# EAGLE design avraic (EAGLE 7.4.0)
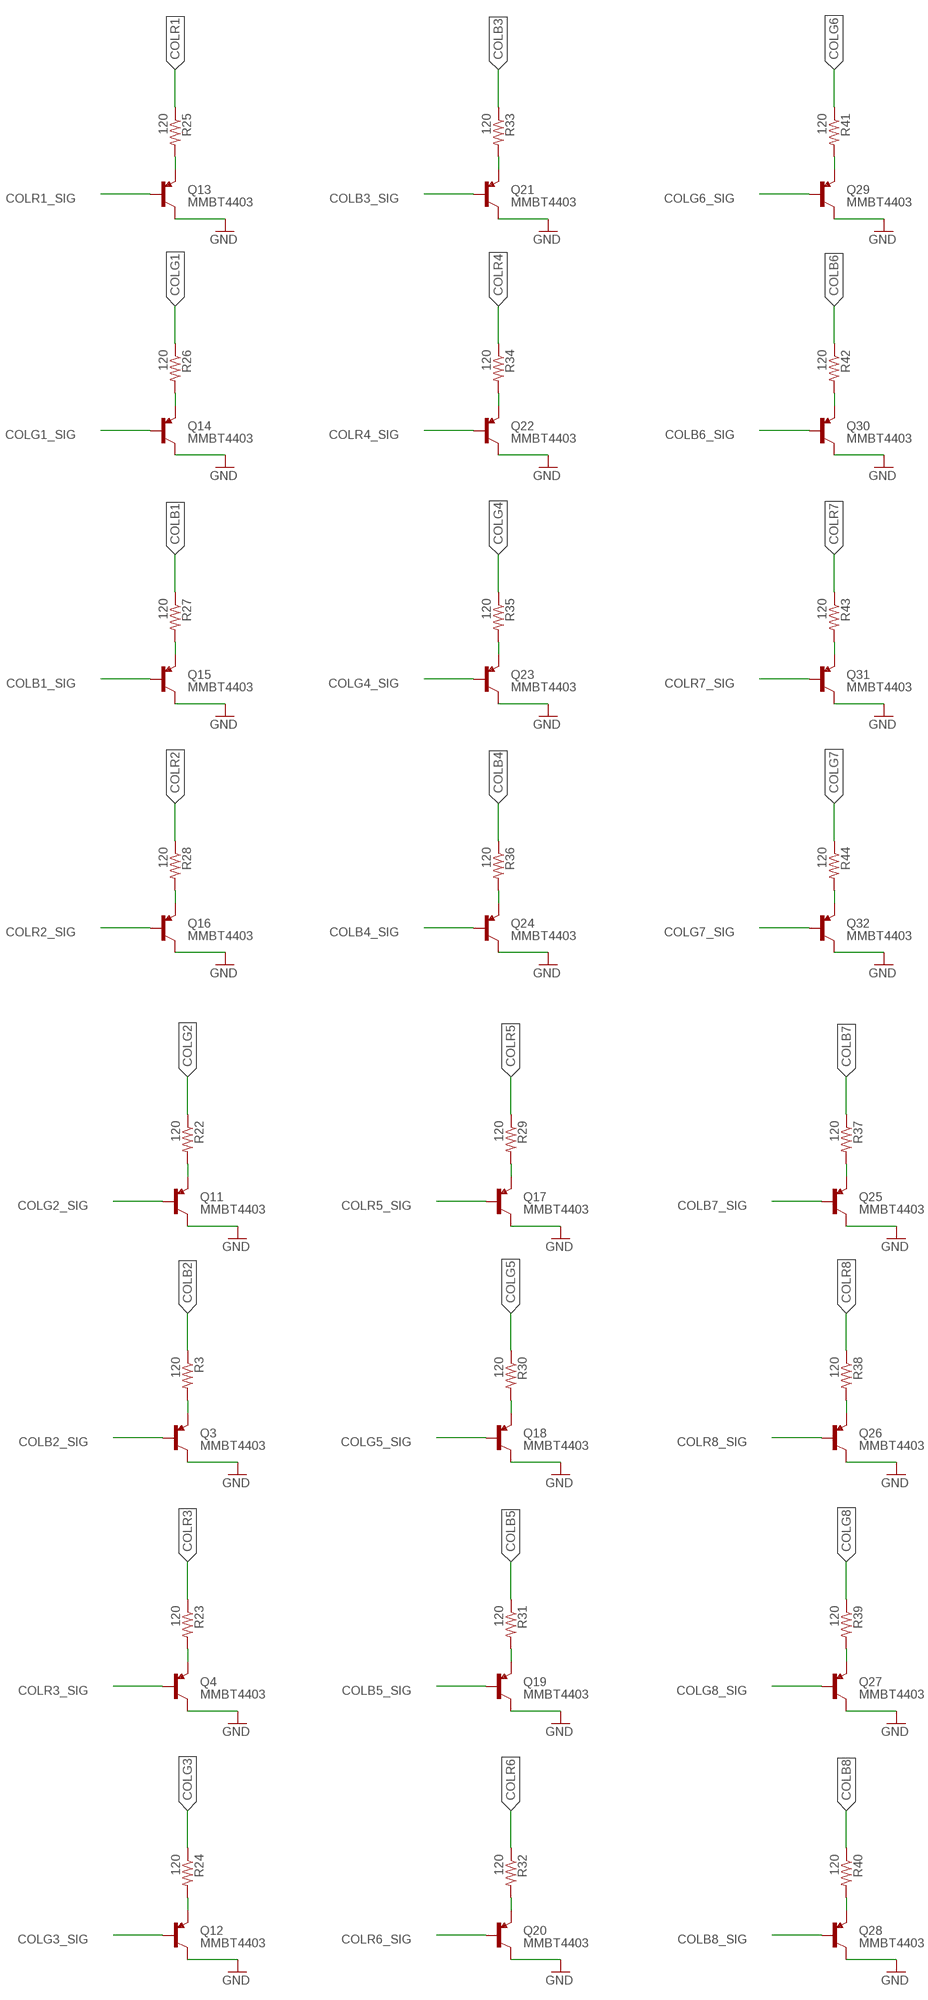
[diagram p0: schematic, sheet 1, part 1 of 3]
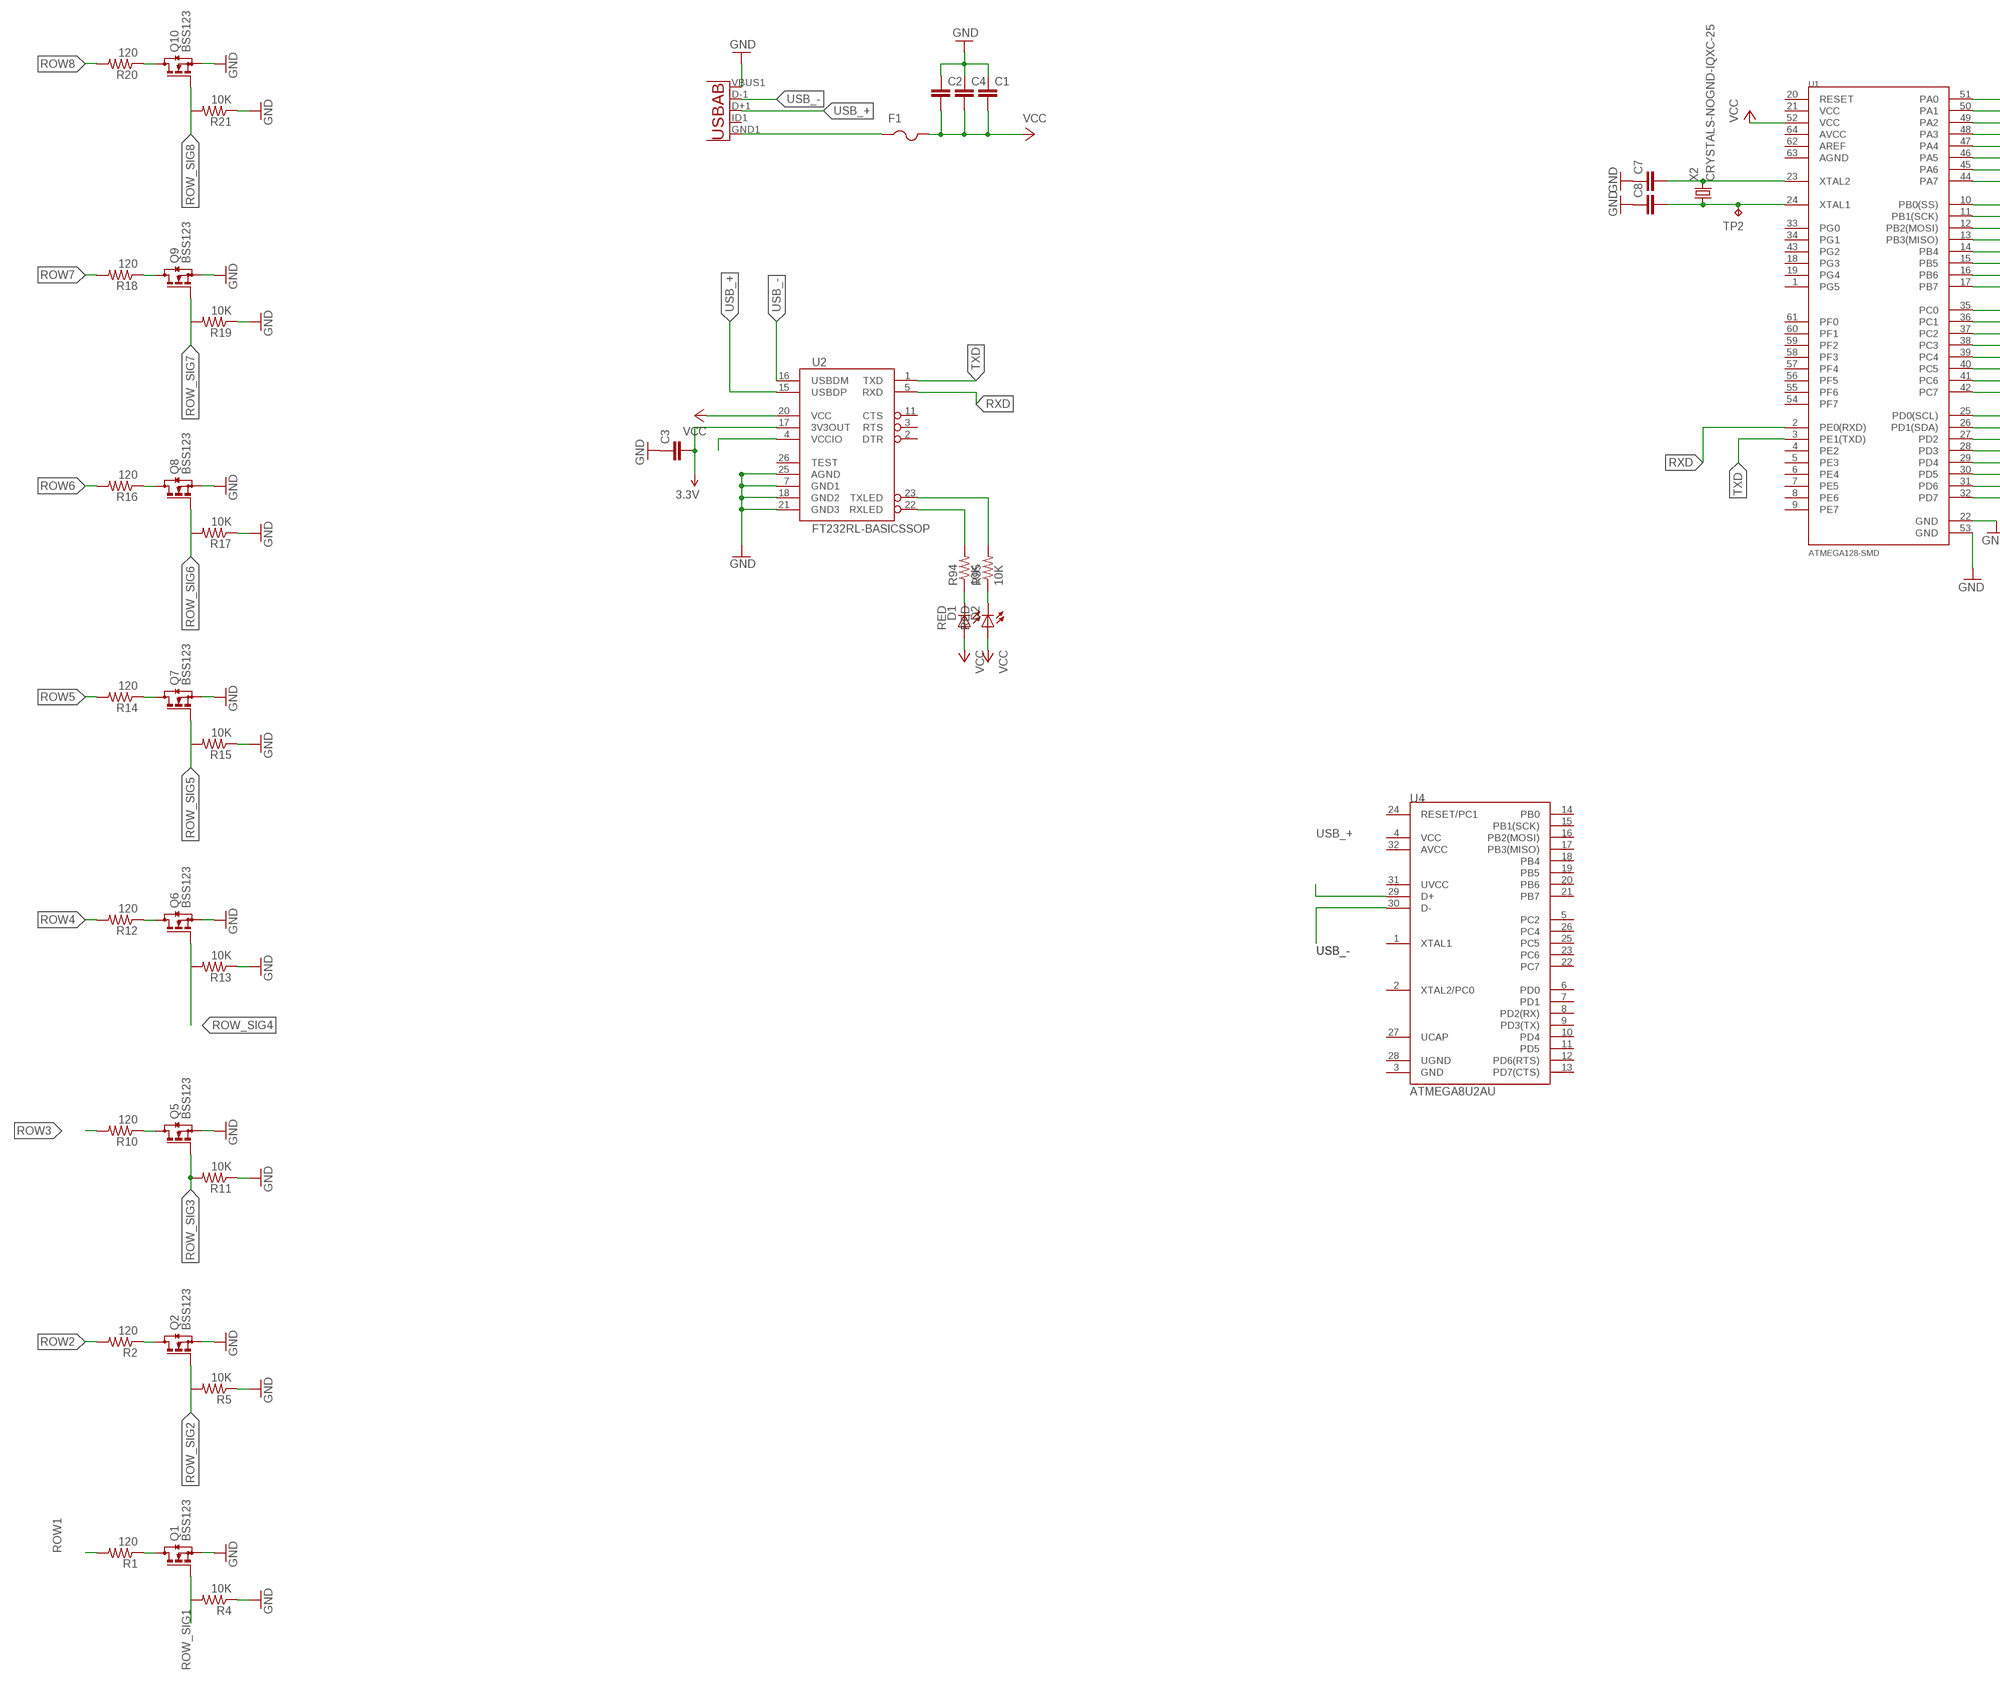
[diagram p1: schematic, sheet 1, part 2 of 3]
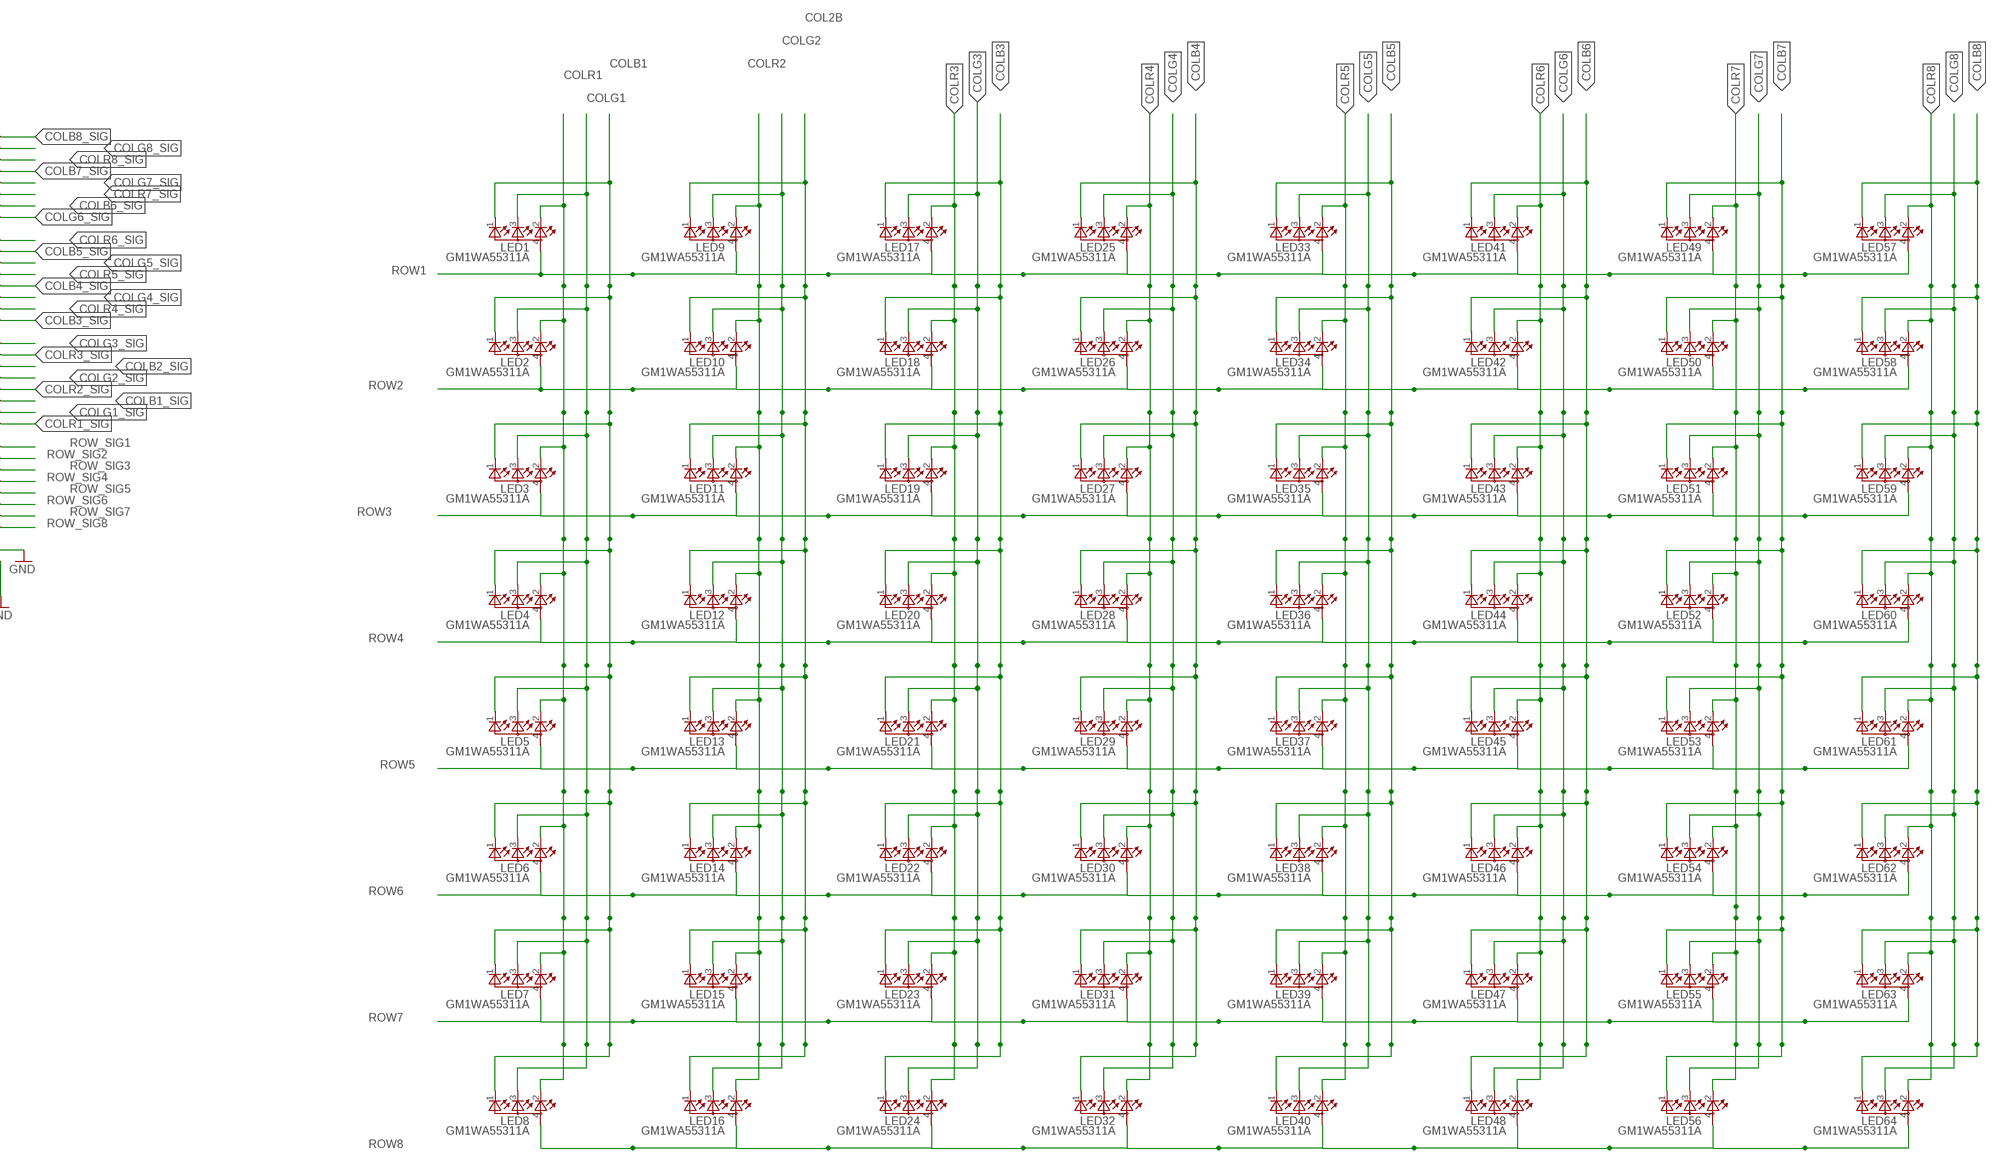
[diagram p2: schematic, sheet 1, part 3 of 3]

## Parts
C1  C-EUC0201  [C0201]
C2  C-EUC0201  [C0201]
C3  C-EUC0402K  [C0402K]
C4  C-EUC0201  [C0201]
C7  C-EUC0402K  [C0402K]
C8  C-EUC0402K  [C0402K]
D1  RED  LEDCHIP-LED0603  [CHIP-LED0603]
D2  RED  LEDCHIP-LED0603  [CHIP-LED0603]
F1  PTCFUSE-1206  [R1206]
LED1  GM1WA55311A  [GM1WA55311A]
LED2  GM1WA55311A  [GM1WA55311A]
LED3  GM1WA55311A  [GM1WA55311A]
LED4  GM1WA55311A  [GM1WA55311A]
LED5  GM1WA55311A  [GM1WA55311A]
LED6  GM1WA55311A  [GM1WA55311A]
LED7  GM1WA55311A  [GM1WA55311A]
LED8  GM1WA55311A  [GM1WA55311A]
LED9  GM1WA55311A  [GM1WA55311A]
LED10  GM1WA55311A  [GM1WA55311A]
LED11  GM1WA55311A  [GM1WA55311A]
LED12  GM1WA55311A  [GM1WA55311A]
LED13  GM1WA55311A  [GM1WA55311A]
LED14  GM1WA55311A  [GM1WA55311A]
LED15  GM1WA55311A  [GM1WA55311A]
LED16  GM1WA55311A  [GM1WA55311A]
LED17  GM1WA55311A  [GM1WA55311A]
LED18  GM1WA55311A  [GM1WA55311A]
LED19  GM1WA55311A  [GM1WA55311A]
LED20  GM1WA55311A  [GM1WA55311A]
LED21  GM1WA55311A  [GM1WA55311A]
LED22  GM1WA55311A  [GM1WA55311A]
LED23  GM1WA55311A  [GM1WA55311A]
LED24  GM1WA55311A  [GM1WA55311A]
LED25  GM1WA55311A  [GM1WA55311A]
LED26  GM1WA55311A  [GM1WA55311A]
LED27  GM1WA55311A  [GM1WA55311A]
LED28  GM1WA55311A  [GM1WA55311A]
LED29  GM1WA55311A  [GM1WA55311A]
LED30  GM1WA55311A  [GM1WA55311A]
LED31  GM1WA55311A  [GM1WA55311A]
LED32  GM1WA55311A  [GM1WA55311A]
LED33  GM1WA55311A  [GM1WA55311A]
LED34  GM1WA55311A  [GM1WA55311A]
LED35  GM1WA55311A  [GM1WA55311A]
LED36  GM1WA55311A  [GM1WA55311A]
LED37  GM1WA55311A  [GM1WA55311A]
LED38  GM1WA55311A  [GM1WA55311A]
LED39  GM1WA55311A  [GM1WA55311A]
LED40  GM1WA55311A  [GM1WA55311A]
LED41  GM1WA55311A  [GM1WA55311A]
LED42  GM1WA55311A  [GM1WA55311A]
LED43  GM1WA55311A  [GM1WA55311A]
LED44  GM1WA55311A  [GM1WA55311A]
LED45  GM1WA55311A  [GM1WA55311A]
LED46  GM1WA55311A  [GM1WA55311A]
LED47  GM1WA55311A  [GM1WA55311A]
LED48  GM1WA55311A  [GM1WA55311A]
LED49  GM1WA55311A  [GM1WA55311A]
LED50  GM1WA55311A  [GM1WA55311A]
LED51  GM1WA55311A  [GM1WA55311A]
LED52  GM1WA55311A  [GM1WA55311A]
LED53  GM1WA55311A  [GM1WA55311A]
LED54  GM1WA55311A  [GM1WA55311A]
LED55  GM1WA55311A  [GM1WA55311A]
LED56  GM1WA55311A  [GM1WA55311A]
LED57  GM1WA55311A  [GM1WA55311A]
LED58  GM1WA55311A  [GM1WA55311A]
LED59  GM1WA55311A  [GM1WA55311A]
LED60  GM1WA55311A  [GM1WA55311A]
LED61  GM1WA55311A  [GM1WA55311A]
LED62  GM1WA55311A  [GM1WA55311A]
LED63  GM1WA55311A  [GM1WA55311A]
LED64  GM1WA55311A  [GM1WA55311A]
Q1  BSS123  [SOT23]
Q2  BSS123  [SOT23]
Q3  MMBT4403  TRANSISTOR_PNPMMBT4403  [SOT23-3]
Q4  MMBT4403  TRANSISTOR_PNPMMBT4403  [SOT23-3]
Q5  BSS123  [SOT23]
Q6  BSS123  [SOT23]
Q7  BSS123  [SOT23]
Q8  BSS123  [SOT23]
Q9  BSS123  [SOT23]
Q10  BSS123  [SOT23]
Q11  MMBT4403  TRANSISTOR_PNPMMBT4403  [SOT23-3]
Q12  MMBT4403  TRANSISTOR_PNPMMBT4403  [SOT23-3]
Q13  MMBT4403  TRANSISTOR_PNPMMBT4403  [SOT23-3]
Q14  MMBT4403  TRANSISTOR_PNPMMBT4403  [SOT23-3]
Q15  MMBT4403  TRANSISTOR_PNPMMBT4403  [SOT23-3]
Q16  MMBT4403  TRANSISTOR_PNPMMBT4403  [SOT23-3]
Q17  MMBT4403  TRANSISTOR_PNPMMBT4403  [SOT23-3]
Q18  MMBT4403  TRANSISTOR_PNPMMBT4403  [SOT23-3]
Q19  MMBT4403  TRANSISTOR_PNPMMBT4403  [SOT23-3]
Q20  MMBT4403  TRANSISTOR_PNPMMBT4403  [SOT23-3]
Q21  MMBT4403  TRANSISTOR_PNPMMBT4403  [SOT23-3]
Q22  MMBT4403  TRANSISTOR_PNPMMBT4403  [SOT23-3]
Q23  MMBT4403  TRANSISTOR_PNPMMBT4403  [SOT23-3]
Q24  MMBT4403  TRANSISTOR_PNPMMBT4403  [SOT23-3]
Q25  MMBT4403  TRANSISTOR_PNPMMBT4403  [SOT23-3]
Q26  MMBT4403  TRANSISTOR_PNPMMBT4403  [SOT23-3]
Q27  MMBT4403  TRANSISTOR_PNPMMBT4403  [SOT23-3]
Q28  MMBT4403  TRANSISTOR_PNPMMBT4403  [SOT23-3]
Q29  MMBT4403  TRANSISTOR_PNPMMBT4403  [SOT23-3]
Q30  MMBT4403  TRANSISTOR_PNPMMBT4403  [SOT23-3]
Q31  MMBT4403  TRANSISTOR_PNPMMBT4403  [SOT23-3]
Q32  MMBT4403  TRANSISTOR_PNPMMBT4403  [SOT23-3]
R1  120  RESISTOR0603-RES  [0603-RES]
R2  120  RESISTOR0603-RES  [0603-RES]
R3  120  R-US_MELF0102R  [MINI_MELF-0102R]
R4  10K  RESISTOR0603-RES  [0603-RES]
R5  10K  RESISTOR0603-RES  [0603-RES]
R10  120  RESISTOR0603-RES  [0603-RES]
R11  10K  RESISTOR0603-RES  [0603-RES]
R12  120  RESISTOR0603-RES  [0603-RES]
R13  10K  RESISTOR0603-RES  [0603-RES]
R14  120  RESISTOR0603-RES  [0603-RES]
R15  10K  RESISTOR0603-RES  [0603-RES]
R16  120  RESISTOR0603-RES  [0603-RES]
R17  10K  RESISTOR0603-RES  [0603-RES]
R18  120  RESISTOR0603-RES  [0603-RES]
R19  10K  RESISTOR0603-RES  [0603-RES]
R20  120  RESISTOR0603-RES  [0603-RES]
R21  10K  RESISTOR0603-RES  [0603-RES]
R22  120  R-US_MELF0102R  [MINI_MELF-0102R]
R23  120  R-US_MELF0102R  [MINI_MELF-0102R]
R24  120  RESISTOR0603-RES  [0603-RES]
R25  120  RESISTOR0603-RES  [0603-RES]
R26  120  R-US_MELF0102R  [MINI_MELF-0102R]
R27  120  R-US_MELF0102R  [MINI_MELF-0102R]
R28  120  R-US_MELF0102R  [MINI_MELF-0102R]
R29  120  R-US_MELF0102R  [MINI_MELF-0102R]
R30  120  RESISTOR0603-RES  [0603-RES]
R31  120  RESISTOR0603-RES  [0603-RES]
R32  120  RESISTOR0603-RES  [0603-RES]
R33  120  R-US_MELF0102R  [MINI_MELF-0102R]
R34  120  R-US_MELF0102R  [MINI_MELF-0102R]
R35  120  R-US_MELF0102R  [MINI_MELF-0102R]
R36  120  R-US_MELF0102R  [MINI_MELF-0102R]
R37  120  R-US_MELF0102R  [MINI_MELF-0102R]
R38  120  R-US_MELF0102R  [MINI_MELF-0102R]
R39  120  R-US_MELF0102R  [MINI_MELF-0102R]
R40  120  R-US_MELF0102R  [MINI_MELF-0102R]
R41  120  R-US_MELF0102R  [MINI_MELF-0102R]
R42  120  R-US_MELF0102R  [MINI_MELF-0102R]
R43  120  R-US_MELF0102R  [MINI_MELF-0102R]
R44  120  R-US_MELF0102R  [MINI_MELF-0102R]
R94  10K  RESISTOR0603-RES  [0603-RES]
R95  10K  RESISTOR0603-RES  [0603-RES]
TP2  TPB1,27  [B1,27]
U1  ATMEGA128-SMD  [TQFP64_14X14MM]
U2  FT232RL-BASICSSOP  [SSOP28DB]
U3  USB""  [USB-MICRO-SMD]
U4  ATMEGA8U2AU  [TQFP32-08]
X2  CRYSTALS-NOGND-IQXC-25  [2.0X1.2-2PAD]

## Nets
3.3V: C3.2 U2.17(3V3OUT)
COL2B: LED9.1(CGREEN) LED10.1(CGREEN) LED11.1(CGREEN) LED12.1(CGREEN) LED13.1(CGREEN) LED14.1(CGREEN) LED15.1(CGREEN) LED16.1(CGREEN)
COLB1: LED1.1(CGREEN) LED2.1(CGREEN) LED3.1(CGREEN) LED4.1(CGREEN) LED5.1(CGREEN) LED6.1(CGREEN) LED7.1(CGREEN) LED8.1(CGREEN) R27.1
COLB1_SIG: Q15.1(B) U1.40(PC5)
COLB2: R3.1
COLB2_SIG: Q3.1(B) U1.37(PC2)
COLB3: LED17.1(CGREEN) LED18.1(CGREEN) LED19.1(CGREEN) LED20.1(CGREEN) LED21.1(CGREEN) LED22.1(CGREEN) LED23.1(CGREEN) LED24.1(CGREEN) R33.1
COLB3_SIG: Q21.1(B) U1.17(PB7)
COLB4: LED25.1(CGREEN) LED26.1(CGREEN) LED27.1(CGREEN) LED28.1(CGREEN) LED29.1(CGREEN) LED30.1(CGREEN) LED31.1(CGREEN) LED32.1(CGREEN) R36.1
COLB4_SIG: Q24.1(B) U1.14(PB4)
COLB5: LED33.1(CGREEN) LED34.1(CGREEN) LED35.1(CGREEN) LED36.1(CGREEN) LED37.1(CGREEN) LED38.1(CGREEN) LED39.1(CGREEN) LED40.1(CGREEN) R31.1
COLB5_SIG: Q19.1(B) U1.11(PB1(SCK))
COLB6: LED41.1(CGREEN) LED42.1(CGREEN) LED43.1(CGREEN) LED44.1(CGREEN) LED45.1(CGREEN) LED46.1(CGREEN) LED47.1(CGREEN) LED48.1(CGREEN) R42.1
COLB6_SIG: Q30.1(B) U1.45(PA6)
COLB7: LED49.1(CGREEN) LED50.1(CGREEN) LED51.1(CGREEN) LED52.1(CGREEN) LED53.1(CGREEN) LED54.1(CGREEN) LED55.1(CGREEN) LED56.1(CGREEN) R37.1
COLB7_SIG: Q25.1(B) U1.48(PA3)
COLB8: LED57.1(CGREEN) LED58.1(CGREEN) LED59.1(CGREEN) LED60.1(CGREEN) LED61.1(CGREEN) LED62.1(CGREEN) LED63.1(CGREEN) LED64.1(CGREEN) R40.1
COLB8_SIG: Q28.1(B) U1.51(PA0)
COLG1: LED1.3(CBLUE) LED2.3(CBLUE) LED3.3(CBLUE) LED4.3(CBLUE) LED5.3(CBLUE) LED6.3(CBLUE) LED7.3(CBLUE) LED8.3(CBLUE) R26.1
COLG1_SIG: Q14.1(B) U1.41(PC6)
COLG2: LED9.3(CBLUE) LED10.3(CBLUE) LED11.3(CBLUE) LED12.3(CBLUE) LED13.3(CBLUE) LED14.3(CBLUE) LED15.3(CBLUE) LED16.3(CBLUE) R22.1
COLG2_SIG: Q11.1(B) U1.38(PC3)
COLG3: LED17.3(CBLUE) LED18.3(CBLUE) LED19.3(CBLUE) LED20.3(CBLUE) LED21.3(CBLUE) LED22.3(CBLUE) LED23.3(CBLUE) LED24.3(CBLUE) R24.1
COLG3_SIG: Q12.1(B) U1.35(PC0)
COLG4: LED25.3(CBLUE) LED26.3(CBLUE) LED27.3(CBLUE) LED28.3(CBLUE) LED29.3(CBLUE) LED30.3(CBLUE) LED31.3(CBLUE) LED32.3(CBLUE) R35.1
COLG4_SIG: Q23.1(B) U1.15(PB5)
COLG5: LED33.3(CBLUE) LED34.3(CBLUE) LED35.3(CBLUE) LED36.3(CBLUE) LED37.3(CBLUE) LED38.3(CBLUE) LED39.3(CBLUE) LED40.3(CBLUE) R30.1
COLG5_SIG: Q18.1(B) U1.12(PB2(MOSI))
COLG6: LED41.3(CBLUE) LED42.3(CBLUE) LED43.3(CBLUE) LED44.3(CBLUE) LED45.3(CBLUE) LED46.3(CBLUE) LED47.3(CBLUE) LED48.3(CBLUE) R41.1
COLG6_SIG: Q29.1(B) U1.44(PA7)
COLG7: LED49.3(CBLUE) LED50.3(CBLUE) LED51.3(CBLUE) LED52.3(CBLUE) LED53.3(CBLUE) LED54.3(CBLUE) LED55.3(CBLUE) LED56.3(CBLUE) R44.1
COLG7_SIG: Q32.1(B) U1.47(PA4)
COLG8: LED57.3(CBLUE) LED58.3(CBLUE) LED59.3(CBLUE) LED60.3(CBLUE) LED61.3(CBLUE) LED62.3(CBLUE) LED63.3(CBLUE) LED64.3(CBLUE) R39.1
COLG8_SIG: Q27.1(B) U1.50(PA1)
COLR1: LED1.2(CRED) LED2.2(CRED) LED3.2(CRED) LED4.2(CRED) LED5.2(CRED) LED6.2(CRED) LED7.2(CRED) LED8.2(CRED) R25.1
COLR1_SIG: Q13.1(B) U1.42(PC7)
COLR2: LED9.2(CRED) LED10.2(CRED) LED11.2(CRED) LED12.2(CRED) LED13.2(CRED) LED14.2(CRED) LED15.2(CRED) LED16.2(CRED) R28.1
COLR2_SIG: Q16.1(B) U1.39(PC4)
COLR3: LED17.2(CRED) LED18.2(CRED) LED19.2(CRED) LED20.2(CRED) LED21.2(CRED) LED22.2(CRED) LED23.2(CRED) LED24.2(CRED) R23.1
COLR3_SIG: Q4.1(B) U1.36(PC1)
COLR4: LED25.2(CRED) LED26.2(CRED) LED27.2(CRED) LED28.2(CRED) LED29.2(CRED) LED30.2(CRED) LED31.2(CRED) LED32.2(CRED) R34.1
COLR4_SIG: Q22.1(B) U1.16(PB6)
COLR5: LED33.2(CRED) LED34.2(CRED) LED35.2(CRED) LED36.2(CRED) LED37.2(CRED) LED38.2(CRED) LED39.2(CRED) LED40.2(CRED) R29.1
COLR5_SIG: Q17.1(B) U1.13(PB3(MISO))
COLR6: LED41.2(CRED) LED42.2(CRED) LED43.2(CRED) LED44.2(CRED) LED45.2(CRED) LED46.2(CRED) LED47.2(CRED) LED48.2(CRED) R32.1
COLR6_SIG: Q20.1(B) U1.10(PB0(SS))
COLR7: LED49.2(CRED) LED50.2(CRED) LED51.2(CRED) LED52.2(CRED) LED53.2(CRED) LED54.2(CRED) LED55.2(CRED) LED56.2(CRED) R43.1
COLR7_SIG: Q31.1(B) U1.46(PA5)
COLR8: LED57.2(CRED) LED58.2(CRED) LED59.2(CRED) LED60.2(CRED) LED61.2(CRED) LED62.2(CRED) LED63.2(CRED) LED64.2(CRED) R38.1
COLR8_SIG: Q26.1(B) U1.49(PA2)
GND: C1.1 C2.1 C3.1 C4.1 C7.1 C8.1 Q1.2(S) Q2.2(S) Q3.3(C) Q4.3(C) Q5.2(S) Q6.2(S) Q7.2(S) Q8.2(S) Q9.2(S) Q10.2(S) Q11.3(C) Q12.3(C) Q13.3(C) Q14.3(C) Q15.3(C) Q16.3(C) Q17.3(C) Q18.3(C) Q19.3(C) Q20.3(C) Q21.3(C) Q22.3(C) Q23.3(C) Q24.3(C) Q25.3(C) Q26.3(C) Q27.3(C) Q28.3(C) Q29.3(C) Q30.3(C) Q31.3(C) Q32.3(C) R4.1 R5.1 R11.1 R13.1 R15.1 R17.1 R19.1 R21.1 U1.22(GND) U1.53(GND) U2.7(GND1) U2.18(GND2) U2.21(GND3) U2.25(AGND) U3.VBUS1(VBUS)
N$1: F1.1 U3.GND1(GND)
N$2: Q11.2(E) R22.2
N$3: Q1.3(D) R1.1
N$4: Q3.2(E) R3.2
N$5: Q4.2(E) R23.2
N$6: Q2.3(D) R2.1
N$7: U2.4(VCCIO)
N$8: D1.C R94.1
N$9: Q12.2(E) R24.2
N$10: D2.C R95.1
N$11: C7.2 U1.23(XTAL2) X2.2
N$12: C8.2 TP2.TP U1.24(XTAL1) X2.1
N$13: Q13.2(E) R25.2
N$14: Q14.2(E) R26.2
N$16: Q15.2(E) R27.2
N$18: Q16.2(E) R28.2
N$19: Q17.2(E) R29.2
N$20: Q18.2(E) R30.2
N$23: Q19.2(E) R31.2
N$24: Q20.2(E) R32.2
N$25: Q21.2(E) R33.2
N$26: Q22.2(E) R34.2
N$27: Q23.2(E) R35.2
N$28: Q24.2(E) R36.2
N$29: Q25.2(E) R37.2
N$30: Q26.2(E) R38.2
N$31: Q27.2(E) R39.2
N$32: Q28.2(E) R40.2
N$33: Q29.2(E) R41.2
N$34: Q30.2(E) R42.2
N$35: Q31.2(E) R43.2
N$36: Q32.2(E) R44.2
N$47: Q5.3(D) R10.1
N$48: Q6.3(D) R12.1
N$49: Q7.3(D) R14.1
N$50: Q8.3(D) R16.1
N$51: Q9.3(D) R18.1
N$54: Q10.3(D) R20.1
N$59: R95.2 U2.23(TXLED)
N$60: R94.2 U2.22(RXLED)
ROW1: LED1.4(A) LED9.4(A) LED17.4(A) LED25.4(A) LED33.4(A) LED41.4(A) LED49.4(A) LED57.4(A) R1.2
ROW2: LED2.4(A) LED10.4(A) LED18.4(A) LED26.4(A) LED34.4(A) LED42.4(A) LED50.4(A) LED58.4(A) R2.2
ROW3: LED3.4(A) LED11.4(A) LED19.4(A) LED27.4(A) LED35.4(A) LED43.4(A) LED51.4(A) LED59.4(A) R10.2
ROW4: LED4.4(A) LED12.4(A) LED20.4(A) LED28.4(A) LED36.4(A) LED44.4(A) LED52.4(A) LED60.4(A) R12.2
ROW5: LED5.4(A) LED13.4(A) LED21.4(A) LED29.4(A) LED37.4(A) LED45.4(A) LED53.4(A) LED61.4(A) R14.2
ROW6: LED6.4(A) LED14.4(A) LED22.4(A) LED30.4(A) LED38.4(A) LED46.4(A) LED54.4(A) LED62.4(A) R16.2
ROW7: LED7.4(A) LED15.4(A) LED23.4(A) LED31.4(A) LED39.4(A) LED47.4(A) LED55.4(A) LED63.4(A) R18.2
ROW8: LED8.4(A) LED16.4(A) LED24.4(A) LED32.4(A) LED40.4(A) LED48.4(A) LED56.4(A) LED64.4(A) R20.2
ROW_SIG1: Q1.1(G) R4.2 U1.25(PD0(SCL))
ROW_SIG2: Q2.1(G) R5.2 U1.26(PD1(SDA))
ROW_SIG3: Q5.1(G) R11.2 U1.27(PD2)
ROW_SIG4: Q6.1(G) R13.2 U1.28(PD3)
ROW_SIG5: Q7.1(G) R15.2 U1.29(PD4)
ROW_SIG6: Q8.1(G) R17.2 U1.30(PD5)
ROW_SIG7: Q9.1(G) R19.2 U1.31(PD6)
ROW_SIG8: Q10.1(G) R21.2 U1.32(PD7)
RXD: U1.2(PE0(RXD)) U2.5(RXD)
TXD: U1.3(PE1(TXD)) U2.1(TXD)
USB_+: U2.15(USBDP) U3.D+1(D+) U4.29(D+)
USB_-: U2.16(USBDM) U3.D-1(D-) U4.30(D-)
VCC: C1.2 C2.2 C4.2 D1.A D2.A F1.2 U1.52(VCC) U2.20(VCC)
Unconnected: U1.1(PG5) U1.4(PE2) U1.5(PE3) U1.6(PE4) U1.7(PE5) U1.8(PE6) U1.9(PE7) U1.18(PG3) U1.19(PG4) U1.20(RESET) U1.21(VCC) U1.33(PG0) U1.34(PG1) U1.43(PG2) U1.54(PF7) U1.55(PF6) U1.56(PF5) U1.57(PF4) U1.58(PF3) U1.59(PF2) U1.60(PF1) U1.61(PF0) U1.62(AREF) U1.63(AGND) U1.64(AVCC) U2.2(DTR) U2.3(RTS) U2.11(CTS) U2.26(TEST) U3.ID1(USBID) U4.1(XTAL1) U4.2(XTAL2/PC0) U4.3(GND) U4.4(VCC) U4.5(PC2) U4.6(PD0) U4.7(PD1) U4.8(PD2(RX)) U4.9(PD3(TX)) U4.10(PD4) U4.11(PD5) U4.12(PD6(RTS)) U4.13(PD7(CTS)) U4.14(PB0) U4.15(PB1(SCK)) U4.16(PB2(MOSI)) U4.17(PB3(MISO)) U4.18(PB4) U4.19(PB5) U4.20(PB6) U4.21(PB7) U4.22(PC7) U4.23(PC6) U4.24(RESET/PC1) U4.25(PC5) U4.26(PC4) U4.27(UCAP) U4.28(UGND) U4.31(UVCC) U4.32(AVCC)

## Library data of the parts
C1-C4 C7 C8 = rcl:C-EU: CAPACITOR, European symbol
D1 D2 = led:LED: LED OSRAM: - CHIPLED LG R971, LG N971, LY N971, LG Q971, LY Q971, LO R971, LY R971 LH N974, LH R974 LS Q976, LO Q976, LY Q976 LO Q996 - Hyper CHIPLED LW Q18S LB Q993, LB Q99A, LB R99A - SideLED LS A670, LO A670, LY A670, LG A670, LP A670 LB A673, LV A673, LT A673, LW A673 LH A674 LY A675 LS A676, LA A676, LO A676, LY A676, LW A676 LS A679, LY A679, LG A679 - Hyper Micro SIDELED® LS Y876, LA Y876, LO Y876, LY Y876 LT Y87S - SmartLED LW L88C, LW L88S LB L89C, LB L89S, LG L890 LS L89K, LO L89K, LY L89K LS L896, LA L896, LO L896, LY L896 - TOPLED LS T670, LO T670, LY T670, LG T670, LP T670 LSG T670, LSP T670, LSY T670, LOP T670, LYG T670 LG T671, LOG T671, LSG T671 LB T673, LV T673, LT T673, LW T673 LH T674 LS T676, LA T676, LO T676, LY T676, LB T676, LH T676, LSB T676, LW T676 LB T67C, LV T67C, LT T67C, LS T67K, LO T67K, LY T67K, LW E67C LS E67B, LA E67B, LO E67B, LY E67B, LB E67C, LV E67C, LT E67C LW T67C LS T679, LY T679, LG T679 LS T770, LO T770, LY T770, LG T770, LP T770 LB T773, LV T773, LT T773, LW T773 LH T774 LS E675, LA E675, LY E675, LS T675 LS T776, LA T776, LO T776, LY T776, LB T776 LHGB T686 LT T68C, LB T68C - Hyper Mini TOPLED® LB M676 - Mini TOPLED Santana® LG M470 LS M47K, LO M47K, LY M47K Source: http://www.osram.convergy.de LUXEON: - LUMILED® LXK2-PW12-R00, LXK2-PW12-S00, LXK2-PW14-U00, LXK2-PW14-V00 LXK2-PM12-R00, LXK2-PM12-S00, LXK2-PM14-U00 LXK2-PE12-Q00, LXK2-PE12-R00, LXK2-PE12-S00, LXK2-PE14-T00, LXK2-PE14-U00 LXK2-PB12-K00, LXK2-PB12-L00, LXK2-PB12-M00, LXK2-PB14-N00, LXK2-PB14-P00, LXK2-PB14-Q00 LXK2-PR12-L00, LXK2-PR12-M00, LXK2-PR14-Q00, LXK2-PR14-R00 LXK2-PD12-Q00, LXK2-PD12-R00, LXK2-PD12-S00 LXK2-PH12-R00, LXK2-PH12-S00 LXK2-PL12-P00, LXK2-PL12-Q00, LXK2-PL12-R00 Source: www.luxeon.com KINGBRIGHT: KA-3528ASYC Source: www.kingbright.com
F1 = adafruit:PTCFUSE: PTC fuses, resettable thermistors
LED1-LED64 = led:GM1WA55311A: Chip LED RGB Source: http://document.sharpsma.com/files/GM1WA55311A_SS.pdf
Q1 Q2 Q5-Q10 = transistor-small-signal:BSS123: N-CHANNEL MOS FET
Q3 Q4 Q11-Q32 = User-Submitted:TRANSISTOR_PNP: Generic PNP BJT Double check pinouts against datasheets- not all devices are the same! MMBT3906 - 40V 200mA SOT-23 (TRANS-08052) MMBT4403 - 40V 600mA SOT-23 (TRANS-09245); PROD_ID: TRANS-09245
R1 R2 R4 R5 R10-R21 R24 R25 R30-R32 R94 R95 = SparkFun:RESISTOR: Resistor Basic schematic elements and footprints for 0603, 1206, and PTH resistors.
R3 R22 R23 R26-R29 R33-R44 = resistor:R-US_: RESISTOR, American symbol
TP2 = testpad:TP: Test pad
U1 = SparkFun-DigitalIC:ATMEGA128: ATmega128/128L/1281/2561. Note: The ATmega128 pin 1 is PEN and the ATmega256/1281 pin 1 is PG5.
U2 = SparkFun-DigitalIC:FT232RL-BASIC: USB UART This is the simplified version of the FT232RL unit. Only what you need, nothing you don't. Spark Fun Electronics SKU : COM-00650; PROD_ID: IC-00870
U3 = MicroUSB:USB: This is a USB AB connector that is compatible with USB OTG. i.e. this connector can serve as a host or device
U4 = SparkFun-DigitalIC:ATMEGA8U2: Atmel 32-pin 8-bit Microcontroller with 8/16/32K Bystes of ISP Flash and USB Controller. ATmega8U2, ATmega16U2, and ATmega32U2
X2 = IQD-Frequency-Products:CRYSTALS-NOGND: CRYSTALS CAN NOT GROUNDED

## Board
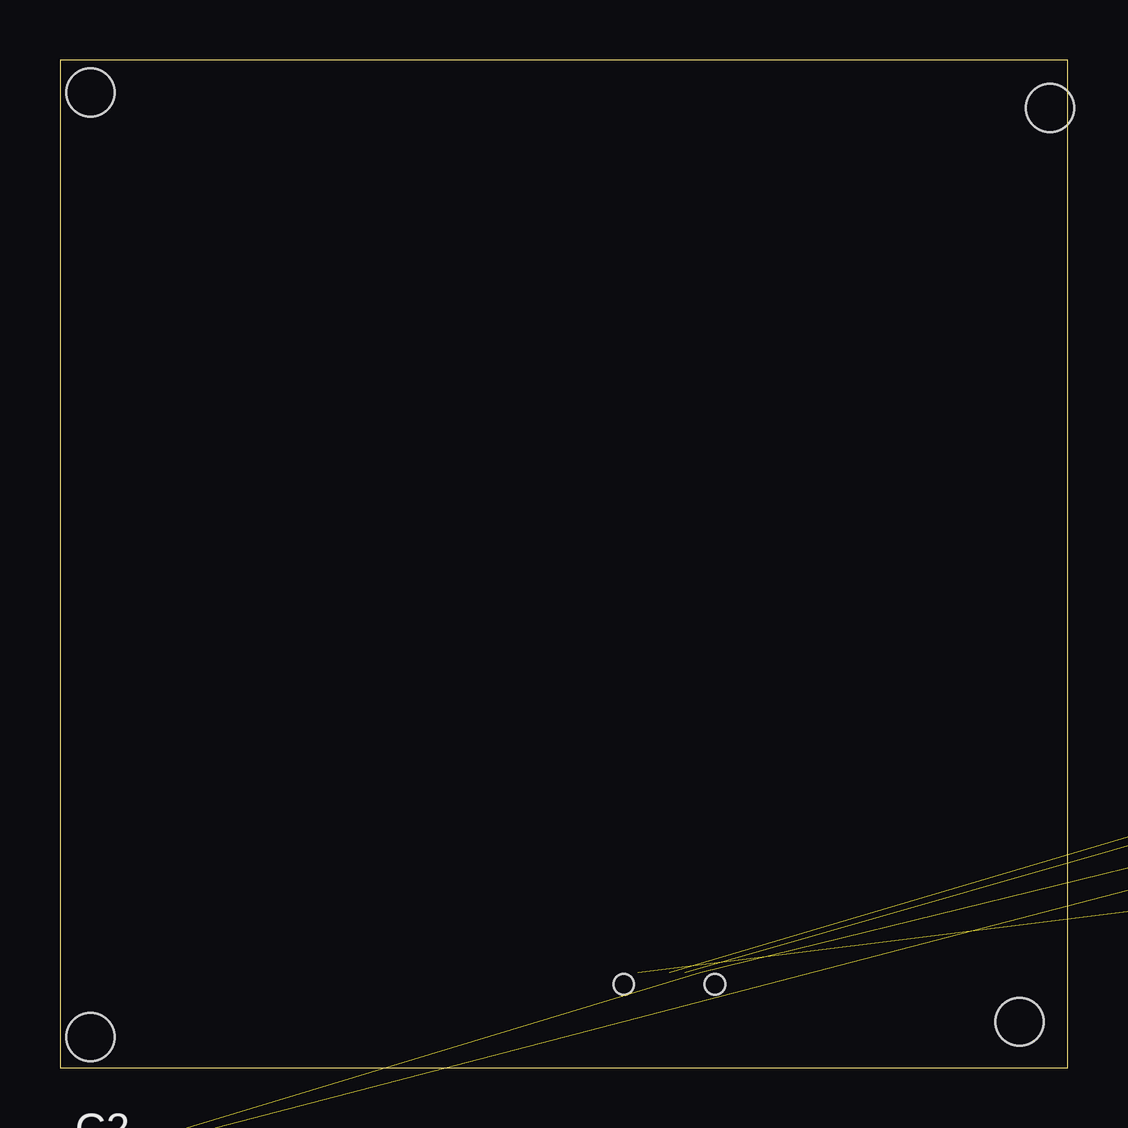
[diagram p3: board, top side]
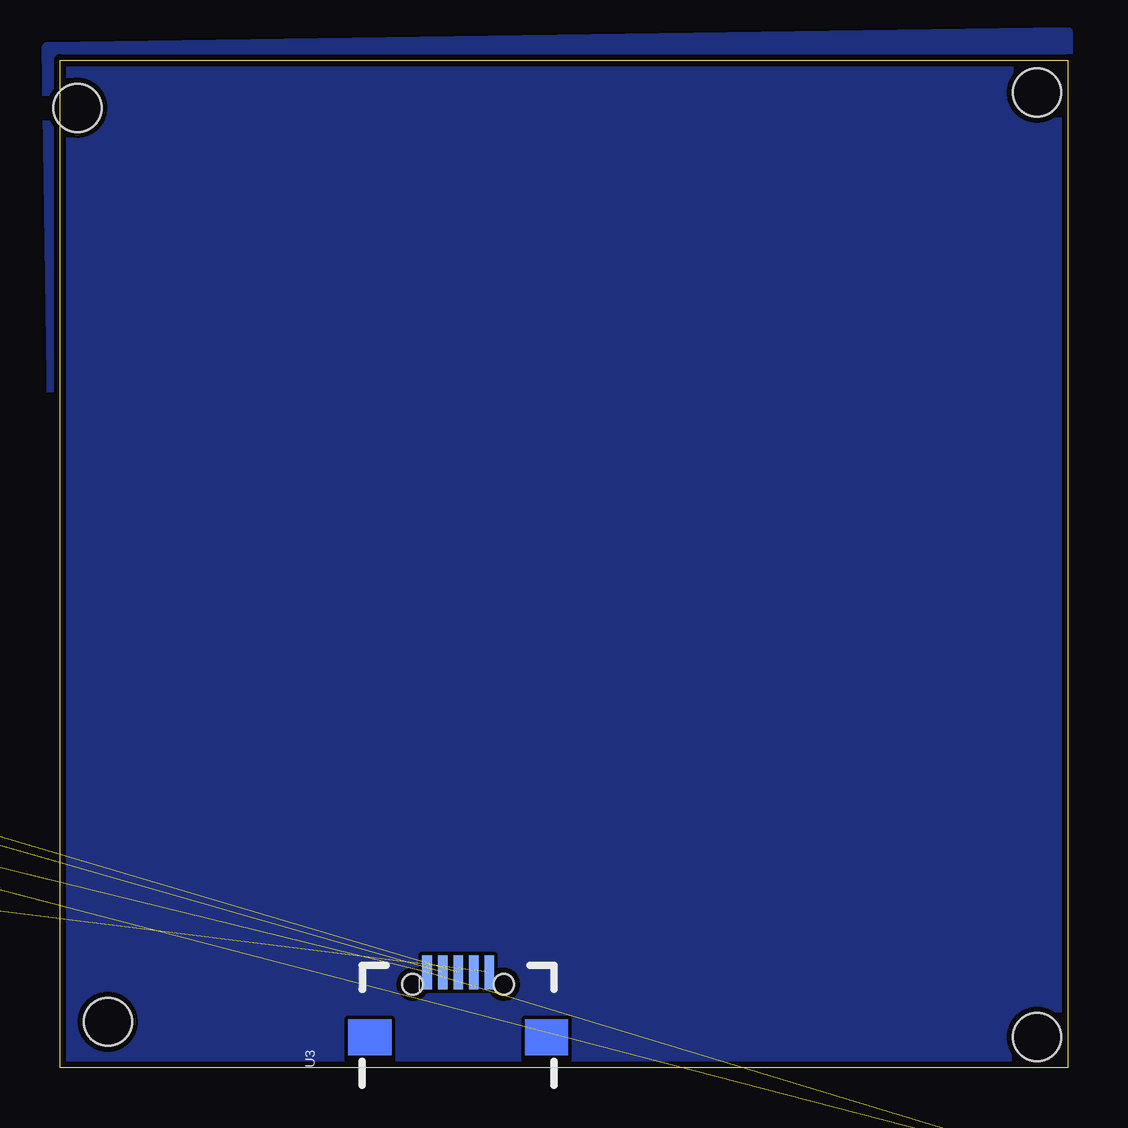
[diagram p4: board, bottom side, seen from below]

Size 42 x 42 mm. Coordinates in mm from the lower left corner, seen from the top.
Outline: 0,0 42,0 42,42 0,42 0,0
Copper layers (1*16): Top 0.035mm / dielectric 1.5mm / Bottom 0.035mm
Design rules "ITEADstudioDRC": minimum track width 6mil, minimum drill 12mil, track to track 6mil, track to pad 6mil, pad to pad 6mil, via to via 6mil, smd to smd 0mil, copper to edge 10mil, drill to drill 10mil, minimum pad ring 10mil, minimum via ring 6mil, stop-mask expansion 2mil, vias tented up to drill 100mil, thermal gap 10mil
Holes 2 mm at 1.27,1.27 1.27,40.64 41.27,40.01 40.01,1.91

### Footprints (pad centres in the part's own frame; a part is rotated, then mirrored left to right if it is on the bottom)
C0201 = smd 0.25 x 0.35: 1 -0.25,0; 2 0.25,0
C0402K = smd 0.925 x 0.74: 1 -0.6,0; 2 0.6,0
CHIP-LED0603 = smd 0.8 x 0.8: A 0,-0.75; C 0,0.75
R1206 = smd 1.6 x 1.803: 1 -1.422,0; 2 1.422,0
GM1WA55311A = smd 0.65 x 1.2: 1 -0.475,0.9; 2 -0.475,-0.9; 3 0.475,-0.9; 4 0.475,0.9
SOT23 = smd 1 x 1.4: 1 -0.95,-1.1; 2 0.95,-1.1; 3 0,1.1
SOT23-3 = smd 0.8 x 0.9: 1 -0.95,-1; 2 0.95,-1; 3 0,1.1
0603-RES = smd 1.1 x 1: 1 -0.85,0; 2 0.85,0
MINI_MELF-0102R = smd 0.5 x 1.3: 1 -0.9,0; 2 0.9,0
B1,27 = smd 1.27 x 1.27: TP 0,0
TQFP64_14X14MM = smd 0.4 x 1.27: 1 -6,-7.6; 2 -5.2,-7.6; 3 -4.4,-7.6; 4 -3.6,-7.6; 5 -2.8,-7.6; 6 -2,-7.6; 7 -1.2,-7.6; 8 -0.4,-7.6; 9 0.4,-7.6; 10 1.2,-7.6; 11 2,-7.6; 12 2.8,-7.6; 13 3.6,-7.6; 14 4.4,-7.6; 15 5.2,-7.6; 16 6,-7.6; 33 6,7.6; 34 5.2,7.6; 35 4.4,7.6; 36 3.6,7.6; 37 2.8,7.6; 38 2,7.6; 39 1.2,7.6; 40 0.4,7.6; 41 -0.4,7.6; 42 -1.2,7.6; 43 -2,7.6; 44 -2.8,7.6; 45 -3.6,7.6; 46 -4.4,7.6; 47 -5.2,7.6; 48 -6,7.6 | smd 1.27 x 0.4: 17 7.6,-6; 18 7.6,-5.2; 19 7.6,-4.4; 20 7.6,-3.6; 21 7.6,-2.8; 22 7.6,-2; 23 7.6,-1.2; 24 7.6,-0.4; 25 7.6,0.4; 26 7.6,1.2; 27 7.6,2; 28 7.6,2.8; 29 7.6,3.6; 30 7.6,4.4; 31 7.6,5.2; 32 7.6,6; 49 -7.6,6; 50 -7.6,5.2; 51 -7.6,4.4; 52 -7.6,3.6; 53 -7.6,2.8; 54 -7.6,2; 55 -7.6,1.2; 56 -7.6,0.4; 57 -7.6,-0.4; 58 -7.6,-1.2; 59 -7.6,-2; 60 -7.6,-2.8; 61 -7.6,-3.6; 62 -7.6,-4.4; 63 -7.6,-5.2; 64 -7.6,-6
SSOP28DB = smd 0.348 x 1.397: 1 -4.225,-3.656; 2 -3.575,-3.656; 3 -2.925,-3.656; 4 -2.275,-3.656; 5 -1.625,-3.656; 6 -0.975,-3.656; 7 -0.325,-3.656; 8 0.325,-3.656; 9 0.975,-3.656; 10 1.625,-3.656; 11 2.275,-3.656; 12 2.925,-3.656; 13 3.575,-3.656; 14 4.225,-3.656; 15 4.225,3.656; 16 3.575,3.656; 17 2.925,3.656; 18 2.275,3.656; 19 1.625,3.656; 20 0.975,3.656; 21 0.325,3.656; 22 -0.325,3.656; 23 -0.975,3.656; 24 -1.625,3.656; 25 -2.275,3.656; 26 -2.925,3.656; 27 -3.575,3.656; 28 -4.225,3.656
USB-MICRO-SMD = smd 1.4 x 0.4: D+1 2.7,0; D-1 2.7,0.65; GND1 2.7,-1.3; ID1 2.7,-0.65; VBUS1 2.7,1.3 | hole 0.85: 2.2,1.9; 2.2,-1.9
TQFP32-08 = smd 1.27 x 0.559: 1 -4.293,2.8; 2 -4.293,2; 3 -4.293,1.2; 4 -4.293,0.4; 5 -4.293,-0.4; 6 -4.293,-1.2; 7 -4.293,-2; 8 -4.293,-2.8; 17 4.293,-2.8; 18 4.293,-2; 19 4.293,-1.2; 20 4.293,-0.4; 21 4.293,0.4; 22 4.293,1.2; 23 4.293,2; 24 4.293,2.8 | smd 0.559 x 1.27: 9 -2.8,-4.293; 10 -2,-4.293; 11 -1.2,-4.293; 12 -0.4,-4.293; 13 0.4,-4.293; 14 1.2,-4.293; 15 2,-4.293; 16 2.8,-4.293; 25 2.8,4.293; 26 2,4.293; 27 1.2,4.293; 28 0.4,4.293; 29 -0.4,4.293; 30 -1.2,4.293; 31 -2,4.293; 32 -2.8,4.293
2.0X1.2-2PAD = smd 0.6 x 1.1: 1 -0.7,0; 2 0.7,0

### Placement (x,y rotation side)
C1  not placed on the board
C2  not placed on the board
C3  not placed on the board
C4  not placed on the board
C7  not placed on the board
C8  not placed on the board
D1  not placed on the board
D2  not placed on the board
F1  not placed on the board
LED1  not placed on the board
LED2  not placed on the board
LED3  not placed on the board
LED4  not placed on the board
LED5  not placed on the board
LED6  not placed on the board
LED7  not placed on the board
LED8  not placed on the board
LED9  not placed on the board
LED10  not placed on the board
LED11  not placed on the board
LED12  not placed on the board
LED13  not placed on the board
LED14  not placed on the board
LED15  not placed on the board
LED16  not placed on the board
LED17  not placed on the board
LED18  not placed on the board
LED19  not placed on the board
LED20  not placed on the board
LED21  not placed on the board
LED22  not placed on the board
LED23  not placed on the board
LED24  not placed on the board
LED25  not placed on the board
LED26  not placed on the board
LED27  not placed on the board
LED28  not placed on the board
LED29  not placed on the board
LED30  not placed on the board
LED31  not placed on the board
LED32  not placed on the board
LED33  not placed on the board
LED34  not placed on the board
LED35  not placed on the board
LED36  not placed on the board
LED37  not placed on the board
LED38  not placed on the board
LED39  not placed on the board
LED40  not placed on the board
LED41  not placed on the board
LED42  not placed on the board
LED43  not placed on the board
LED44  not placed on the board
LED45  not placed on the board
LED46  not placed on the board
LED47  not placed on the board
LED48  not placed on the board
LED49  not placed on the board
LED50  not placed on the board
LED51  not placed on the board
LED52  not placed on the board
LED53  not placed on the board
LED54  not placed on the board
LED55  not placed on the board
LED56  not placed on the board
LED57  not placed on the board
LED58  not placed on the board
LED59  not placed on the board
LED60  not placed on the board
LED61  not placed on the board
LED62  not placed on the board
LED63  not placed on the board
LED64  not placed on the board
Q1  not placed on the board
Q2  not placed on the board
Q3  not placed on the board
Q4  not placed on the board
Q5  not placed on the board
Q6  not placed on the board
Q7  not placed on the board
Q8  not placed on the board
Q9  not placed on the board
Q10  not placed on the board
Q11  not placed on the board
Q12  not placed on the board
Q13  not placed on the board
Q14  not placed on the board
Q15  not placed on the board
Q16  not placed on the board
Q17  not placed on the board
Q18  not placed on the board
Q19  not placed on the board
Q20  not placed on the board
Q21  not placed on the board
Q22  not placed on the board
Q23  not placed on the board
Q24  not placed on the board
Q25  not placed on the board
Q26  not placed on the board
Q27  not placed on the board
Q28  not placed on the board
Q29  not placed on the board
Q30  not placed on the board
Q31  not placed on the board
Q32  not placed on the board
R1  not placed on the board
R2  not placed on the board
R3  not placed on the board
R4  not placed on the board
R5  not placed on the board
R10  not placed on the board
R11  not placed on the board
R12  not placed on the board
R13  not placed on the board
R14  not placed on the board
R15  not placed on the board
R16  not placed on the board
R17  not placed on the board
R18  not placed on the board
R19  not placed on the board
R20  not placed on the board
R21  not placed on the board
R22  not placed on the board
R23  not placed on the board
R24  not placed on the board
R25  not placed on the board
R26  not placed on the board
R27  not placed on the board
R28  not placed on the board
R29  not placed on the board
R30  not placed on the board
R31  not placed on the board
R32  not placed on the board
R33  not placed on the board
R34  not placed on the board
R35  not placed on the board
R36  not placed on the board
R37  not placed on the board
R38  not placed on the board
R39  not placed on the board
R40  not placed on the board
R41  not placed on the board
R42  not placed on the board
R43  not placed on the board
R44  not placed on the board
R94  not placed on the board
R95  not placed on the board
TP2  not placed on the board
U1  not placed on the board
U2  not placed on the board
U3  25.4,1.27 90 bottom
U4  not placed on the board
X2  not placed on the board

### Tracks (layer width: path | path; a pad name or v marks a point on that pad's centre or on a via)
3.3V  (1 unrouted)
COL2B  (7 unrouted)
COLB1  (8 unrouted)
COLB1_SIG  (1 unrouted)
COLB2_SIG  (1 unrouted)
COLB3  (8 unrouted)
COLB3_SIG  (1 unrouted)
COLB4  (8 unrouted)
COLB4_SIG  (1 unrouted)
COLB5  (8 unrouted)
COLB5_SIG  (1 unrouted)
COLB6  (8 unrouted)
COLB6_SIG  (1 unrouted)
COLB7  (8 unrouted)
COLB7_SIG  (1 unrouted)
COLB8  (8 unrouted)
COLB8_SIG  (1 unrouted)
COLG1  (8 unrouted)
COLG1_SIG  (1 unrouted)
COLG2  (8 unrouted)
COLG2_SIG  (1 unrouted)
COLG3  (8 unrouted)
COLG3_SIG  (1 unrouted)
COLG4  (8 unrouted)
COLG4_SIG  (1 unrouted)
COLG5  (8 unrouted)
COLG5_SIG  (1 unrouted)
COLG6  (8 unrouted)
COLG6_SIG  (1 unrouted)
COLG7  (8 unrouted)
COLG7_SIG  (1 unrouted)
COLG8  (8 unrouted)
COLG8_SIG  (1 unrouted)
COLR1  (8 unrouted)
COLR1_SIG  (1 unrouted)
COLR2  (8 unrouted)
COLR2_SIG  (1 unrouted)
COLR3  (8 unrouted)
COLR3_SIG  (1 unrouted)
COLR4  (8 unrouted)
COLR4_SIG  (1 unrouted)
COLR5  (8 unrouted)
COLR5_SIG  (1 unrouted)
COLR6  (8 unrouted)
COLR6_SIG  (1 unrouted)
COLR7  (8 unrouted)
COLR7_SIG  (1 unrouted)
COLR8  (8 unrouted)
COLR8_SIG  (1 unrouted)
FND
  pour Bottom: 0,43.18 0,0 41.91,0 42.55,42.55
GND  (52 unrouted)
N$1  (1 unrouted)
N$2  (1 unrouted)
N$3  (1 unrouted)
N$4  (1 unrouted)
N$5  (1 unrouted)
N$6  (1 unrouted)
N$8  (1 unrouted)
N$9  (1 unrouted)
N$10  (1 unrouted)
N$11  (2 unrouted)
N$12  (3 unrouted)
N$13  (1 unrouted)
N$14  (1 unrouted)
N$16  (1 unrouted)
N$18  (1 unrouted)
N$19  (1 unrouted)
N$20  (1 unrouted)
N$23  (1 unrouted)
N$24  (1 unrouted)
N$25  (1 unrouted)
N$26  (1 unrouted)
N$27  (1 unrouted)
N$28  (1 unrouted)
N$29  (1 unrouted)
N$30  (1 unrouted)
N$31  (1 unrouted)
N$32  (1 unrouted)
N$33  (1 unrouted)
N$34  (1 unrouted)
N$35  (1 unrouted)
N$36  (1 unrouted)
N$47  (1 unrouted)
N$48  (1 unrouted)
N$49  (1 unrouted)
N$50  (1 unrouted)
N$51  (1 unrouted)
N$54  (1 unrouted)
N$59  (1 unrouted)
N$60  (1 unrouted)
ROW1  (8 unrouted)
ROW2  (8 unrouted)
ROW3  (8 unrouted)
ROW4  (8 unrouted)
ROW5  (8 unrouted)
ROW6  (8 unrouted)
ROW7  (8 unrouted)
ROW8  (8 unrouted)
ROW_SIG1  (2 unrouted)
ROW_SIG2  (2 unrouted)
ROW_SIG3  (2 unrouted)
ROW_SIG4  (2 unrouted)
ROW_SIG5  (2 unrouted)
ROW_SIG6  (2 unrouted)
ROW_SIG7  (2 unrouted)
ROW_SIG8  (2 unrouted)
RXD  (1 unrouted)
TXD  (1 unrouted)
USB_+  (2 unrouted)
USB_-  (2 unrouted)
VCC  (7 unrouted)